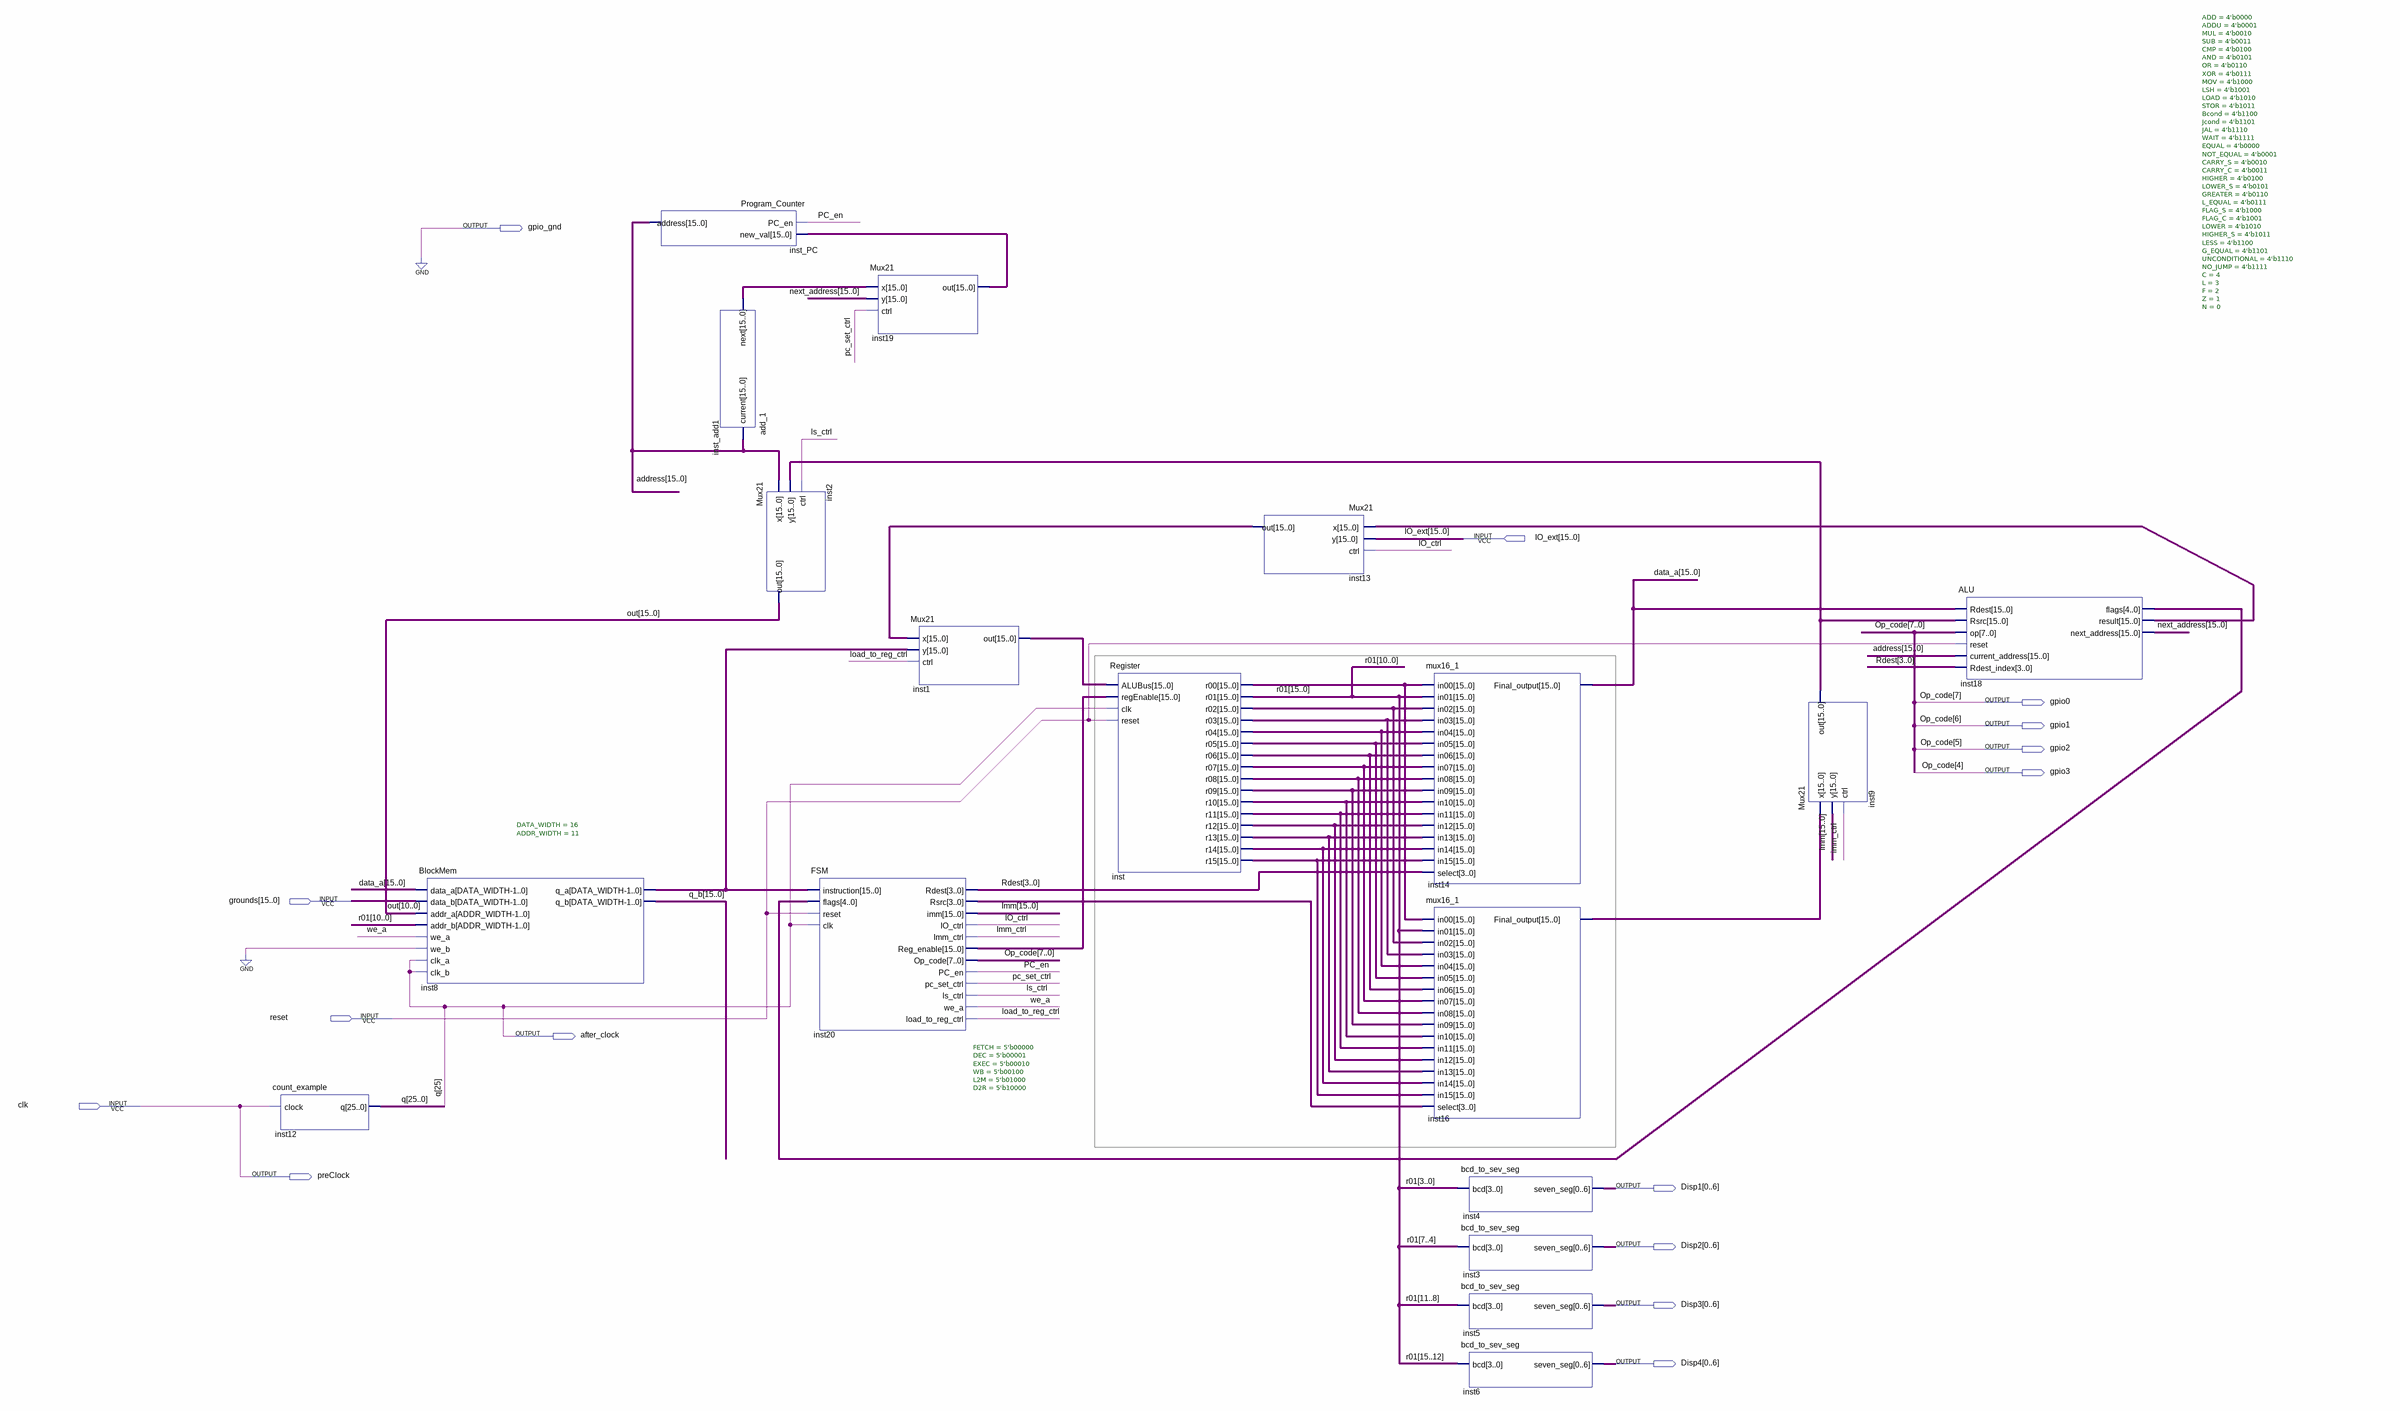
[diagram p0: schematic sheet]
// Quartus schematic tb_CPU.bdf as structural Verilog: 18 symbols, 15 pins
module tb_CPU (
  input  [15:0] IO_ext,
  input  [15:0] grounds,
  input  reset,
  input  clk,
  output gpio_gnd,
  output gpio0,
  output gpio1,
  output gpio2,
  output gpio3,
  output after_clock,
  output preClock,
  output [0:6] Disp1,
  output [0:6] Disp2,
  output [0:6] Disp3,
  output [0:6] Disp4
);

  wire imm_ctrl, IO_ctrl, load_to_reg_ctrl, ls_ctrl, PC_en, pc_set_ctrl, we_a;
  wire [3:0] inst20_rsrc, Op_code, Rdest;
  wire [4:0] inst18_flags;
  wire [15:0] address, data_a, Imm, inst1_out, inst8_q_a, inst9_out, inst13_out, inst16_final_output,
       inst18_result, inst19_out, inst20_reg_enable, inst_add1_next, inst_r00, inst_r02, inst_r03, inst_r04,
       inst_r05, inst_r06, inst_r07, inst_r08, inst_r09, inst_r10, inst_r11, inst_r12, inst_r13, inst_r14,
       inst_r15, next_address, out, q_b, r01;
  wire [24:0] q;

  count_example inst12 (.clock(clk), .q({after_clock, q}));
  BlockMem #(.DATA_WIDTH(16), .ADDR_WIDTH(11)) inst8 (
    .data_a(data_a), .data_b(grounds), .addr_a(out[10:0]), .addr_b(r01[10:0]), .we_a(we_a), .we_b(1'b0),
    .clk_a(after_clock), .clk_b(after_clock), .q_a(inst8_q_a), .q_b(q_b));
  Program_Counter inst_PC (.PC_en(PC_en), .new_val(inst19_out), .address(address));
  add_1 inst_add1 (.current(address), .next(inst_add1_next));
  Mux21 inst2 (.x(address), .y(inst9_out), .ctrl(ls_ctrl), .out(out));
  FSM #(.FETCH(5'b00000), .DEC(5'b00001), .EXEC(5'b00010), .WB(5'b00100), .L2M(5'b01000), .D2R(5'b10000)) inst20 (
    .instruction(inst8_q_a), .flags(inst18_flags), .reset(reset), .clk(after_clock), .Rdest(Rdest),
    .Rsrc(inst20_rsrc), .imm(Imm), .IO_ctrl(IO_ctrl), .Imm_ctrl(imm_ctrl), .Reg_enable(inst20_reg_enable),
    .Op_code({gpio0, gpio1, gpio2, gpio3, Op_code}), .PC_en(PC_en), .pc_set_ctrl(pc_set_ctrl),
    .ls_ctrl(ls_ctrl), .we_a(we_a), .load_to_reg_ctrl(load_to_reg_ctrl));
  Mux21 inst19 (.x(inst_add1_next), .y(next_address), .ctrl(pc_set_ctrl), .out(inst19_out));
  Mux21 inst1 (.x(inst13_out), .y(inst8_q_a), .ctrl(load_to_reg_ctrl), .out(inst1_out));
  Register inst (
    .ALUBus(inst1_out), .regEnable(inst20_reg_enable), .clk(after_clock), .reset(reset), .r00(inst_r00),
    .r01(r01), .r02(inst_r02), .r03(inst_r03), .r04(inst_r04), .r05(inst_r05), .r06(inst_r06),
    .r07(inst_r07), .r08(inst_r08), .r09(inst_r09), .r10(inst_r10), .r11(inst_r11), .r12(inst_r12),
    .r13(inst_r13), .r14(inst_r14), .r15(inst_r15));
  Mux21 inst13 (.x(inst18_result), .y(IO_ext), .ctrl(IO_ctrl), .out(inst13_out));
  mux16_1 inst14 (
    .in00(inst_r00), .in01(r01), .in02(inst_r02), .in03(inst_r03), .in04(inst_r04), .in05(inst_r05),
    .in06(inst_r06), .in07(inst_r07), .in08(inst_r08), .in09(inst_r09), .in10(inst_r10), .in11(inst_r11),
    .in12(inst_r12), .in13(inst_r13), .in14(inst_r14), .in15(inst_r15), .select(Rdest), .Final_output(data_a));
  mux16_1 inst16 (
    .in00(inst_r00), .in01(r01), .in02(inst_r02), .in03(inst_r03), .in04(inst_r04), .in05(inst_r05),
    .in06(inst_r06), .in07(inst_r07), .in08(inst_r08), .in09(inst_r09), .in10(inst_r10), .in11(inst_r11),
    .in12(inst_r12), .in13(inst_r13), .in14(inst_r14), .in15(inst_r15), .select(inst20_rsrc),
    .Final_output(inst16_final_output));
  bcd_to_sev_seg inst4 (.bcd(r01[3:0]), .seven_seg(Disp1));
  bcd_to_sev_seg inst3 (.bcd(r01[7:4]), .seven_seg(Disp2));
  bcd_to_sev_seg inst5 (.bcd(r01[11:8]), .seven_seg(Disp3));
  bcd_to_sev_seg inst6 (.bcd(r01[15:12]), .seven_seg(Disp4));
  Mux21 inst9 (.x(inst16_final_output), .y(Imm), .ctrl(imm_ctrl), .out(inst9_out));
  ALU #(.ADD(4'b0000), .ADDU(4'b0001), .MUL(4'b0010), .SUB(4'b0011), .CMP(4'b0100), .AND(4'b0101), .OR(4'b0110), .XOR(4'b0111), .MOV(4'b1000), .LSH(4'b1001), .LOAD(4'b1010), .STOR(4'b1011), .Bcond(4'b1100), .Jcond(4'b1101), .JAL(4'b1110), .WAIT(4'b1111), .EQUAL(4'b0000), .NOT_EQUAL(4'b0001), .CARRY_S(4'b0010), .CARRY_C(4'b0011), .HIGHER(4'b0100), .LOWER_S(4'b0101), .GREATER(4'b0110), .L_EQUAL(4'b0111), .FLAG_S(4'b1000), .FLAG_C(4'b1001), .LOWER(4'b1010), .HIGHER_S(4'b1011), .LESS(4'b1100), .G_EQUAL(4'b1101), .UNCONDITIONAL(4'b1110), .NO_JUMP(4'b1111), .C(4), .L(3), .F(2), .Z(1), .N(0)) inst18 (
    .Rdest(data_a), .Rsrc(inst9_out), .op({gpio0, gpio1, gpio2, gpio3, Op_code}), .reset(reset),
    .current_address(address), .Rdest_index(Rdest), .flags(inst18_flags), .result(inst18_result),
    .next_address(next_address));

  assign gpio_gnd = 1'b0;
  assign preClock = clk;

  // Other names for the same wires on the sheet: Op_code[7:4] = {gpio0, gpio1, gpio2, gpio3}; q[25] = after_clock
endmodule
